# EasyEDA Pro project ProPrj_AmatronWithOpto_Flex_2026-01-19.epro

# Schematic AmatronWithOpto

## Sheets
1 SWITCH_OPTO
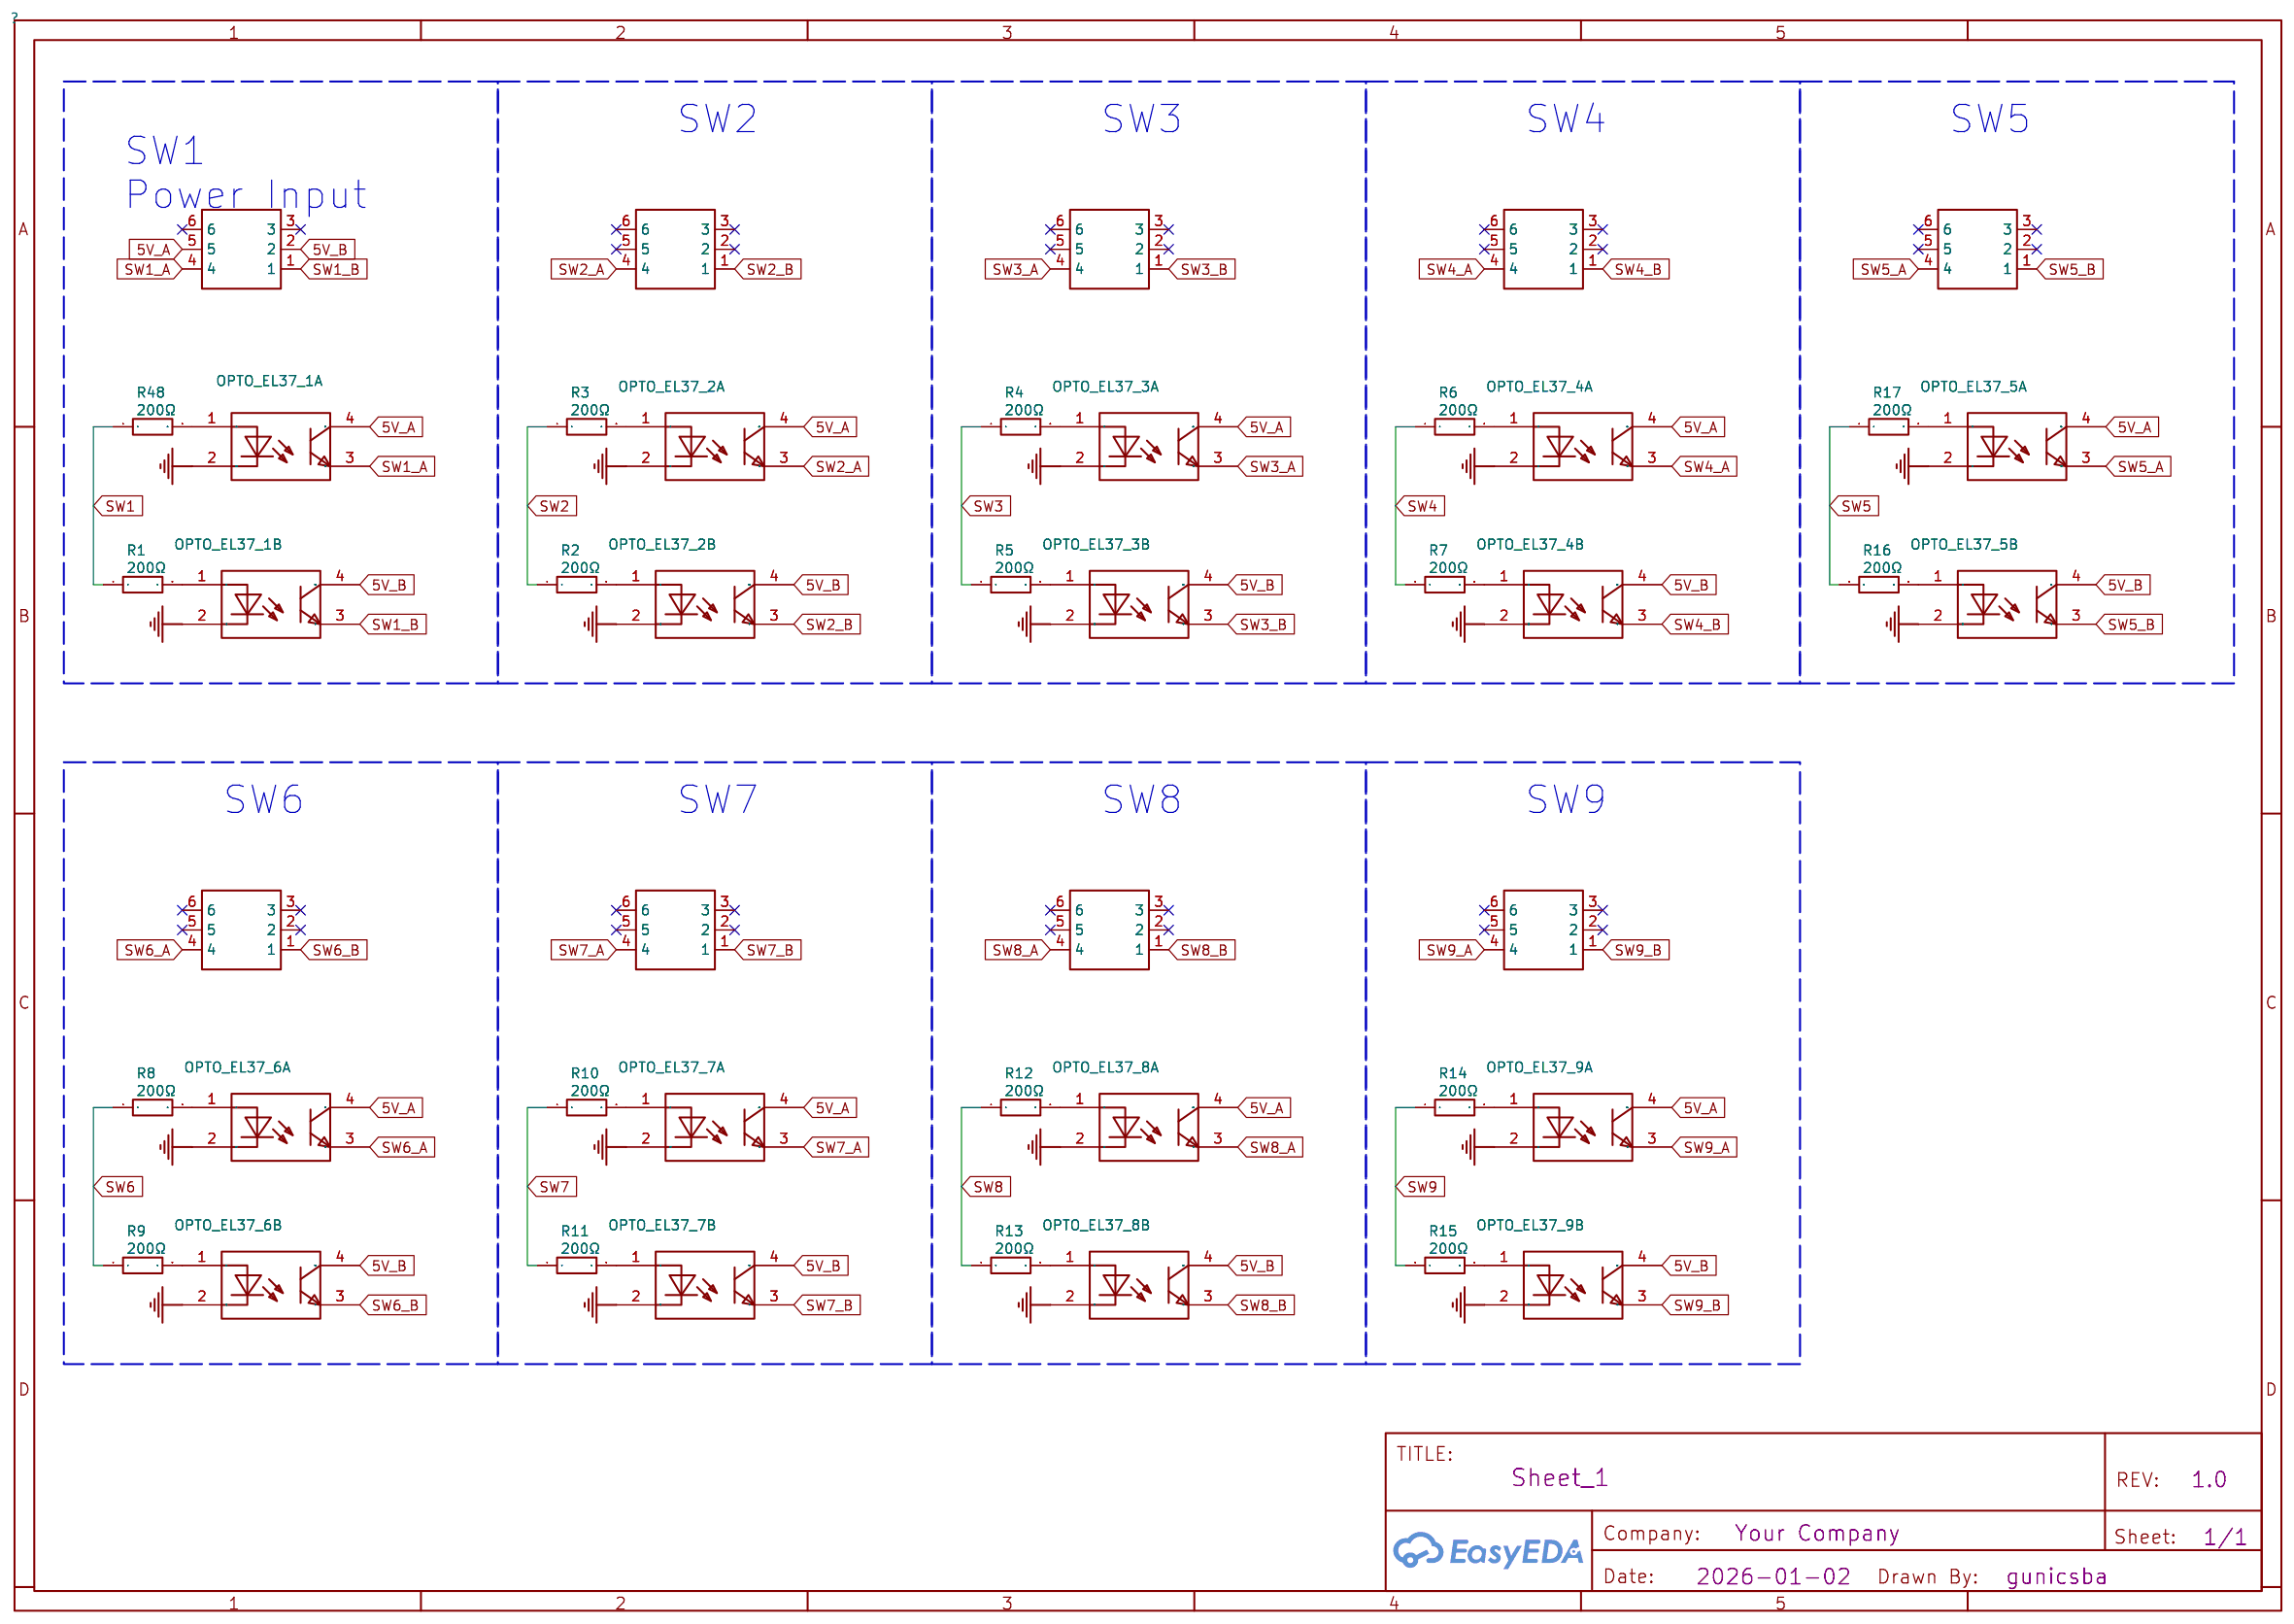
[diagram p0: SWITCH_OPTO]
2 DRIVER_POWER: Board Name: AmatronWithOpto; Create Date: 2026-01-02; Page Name: DRIVER_POWER; Project Name: AmatronWithOpto_Flex; Schematic Name: AmatronWithOpto; Update Date: 2026-01-02; Company: EasyEDA.com; Page Size: A4; Version: V1.0
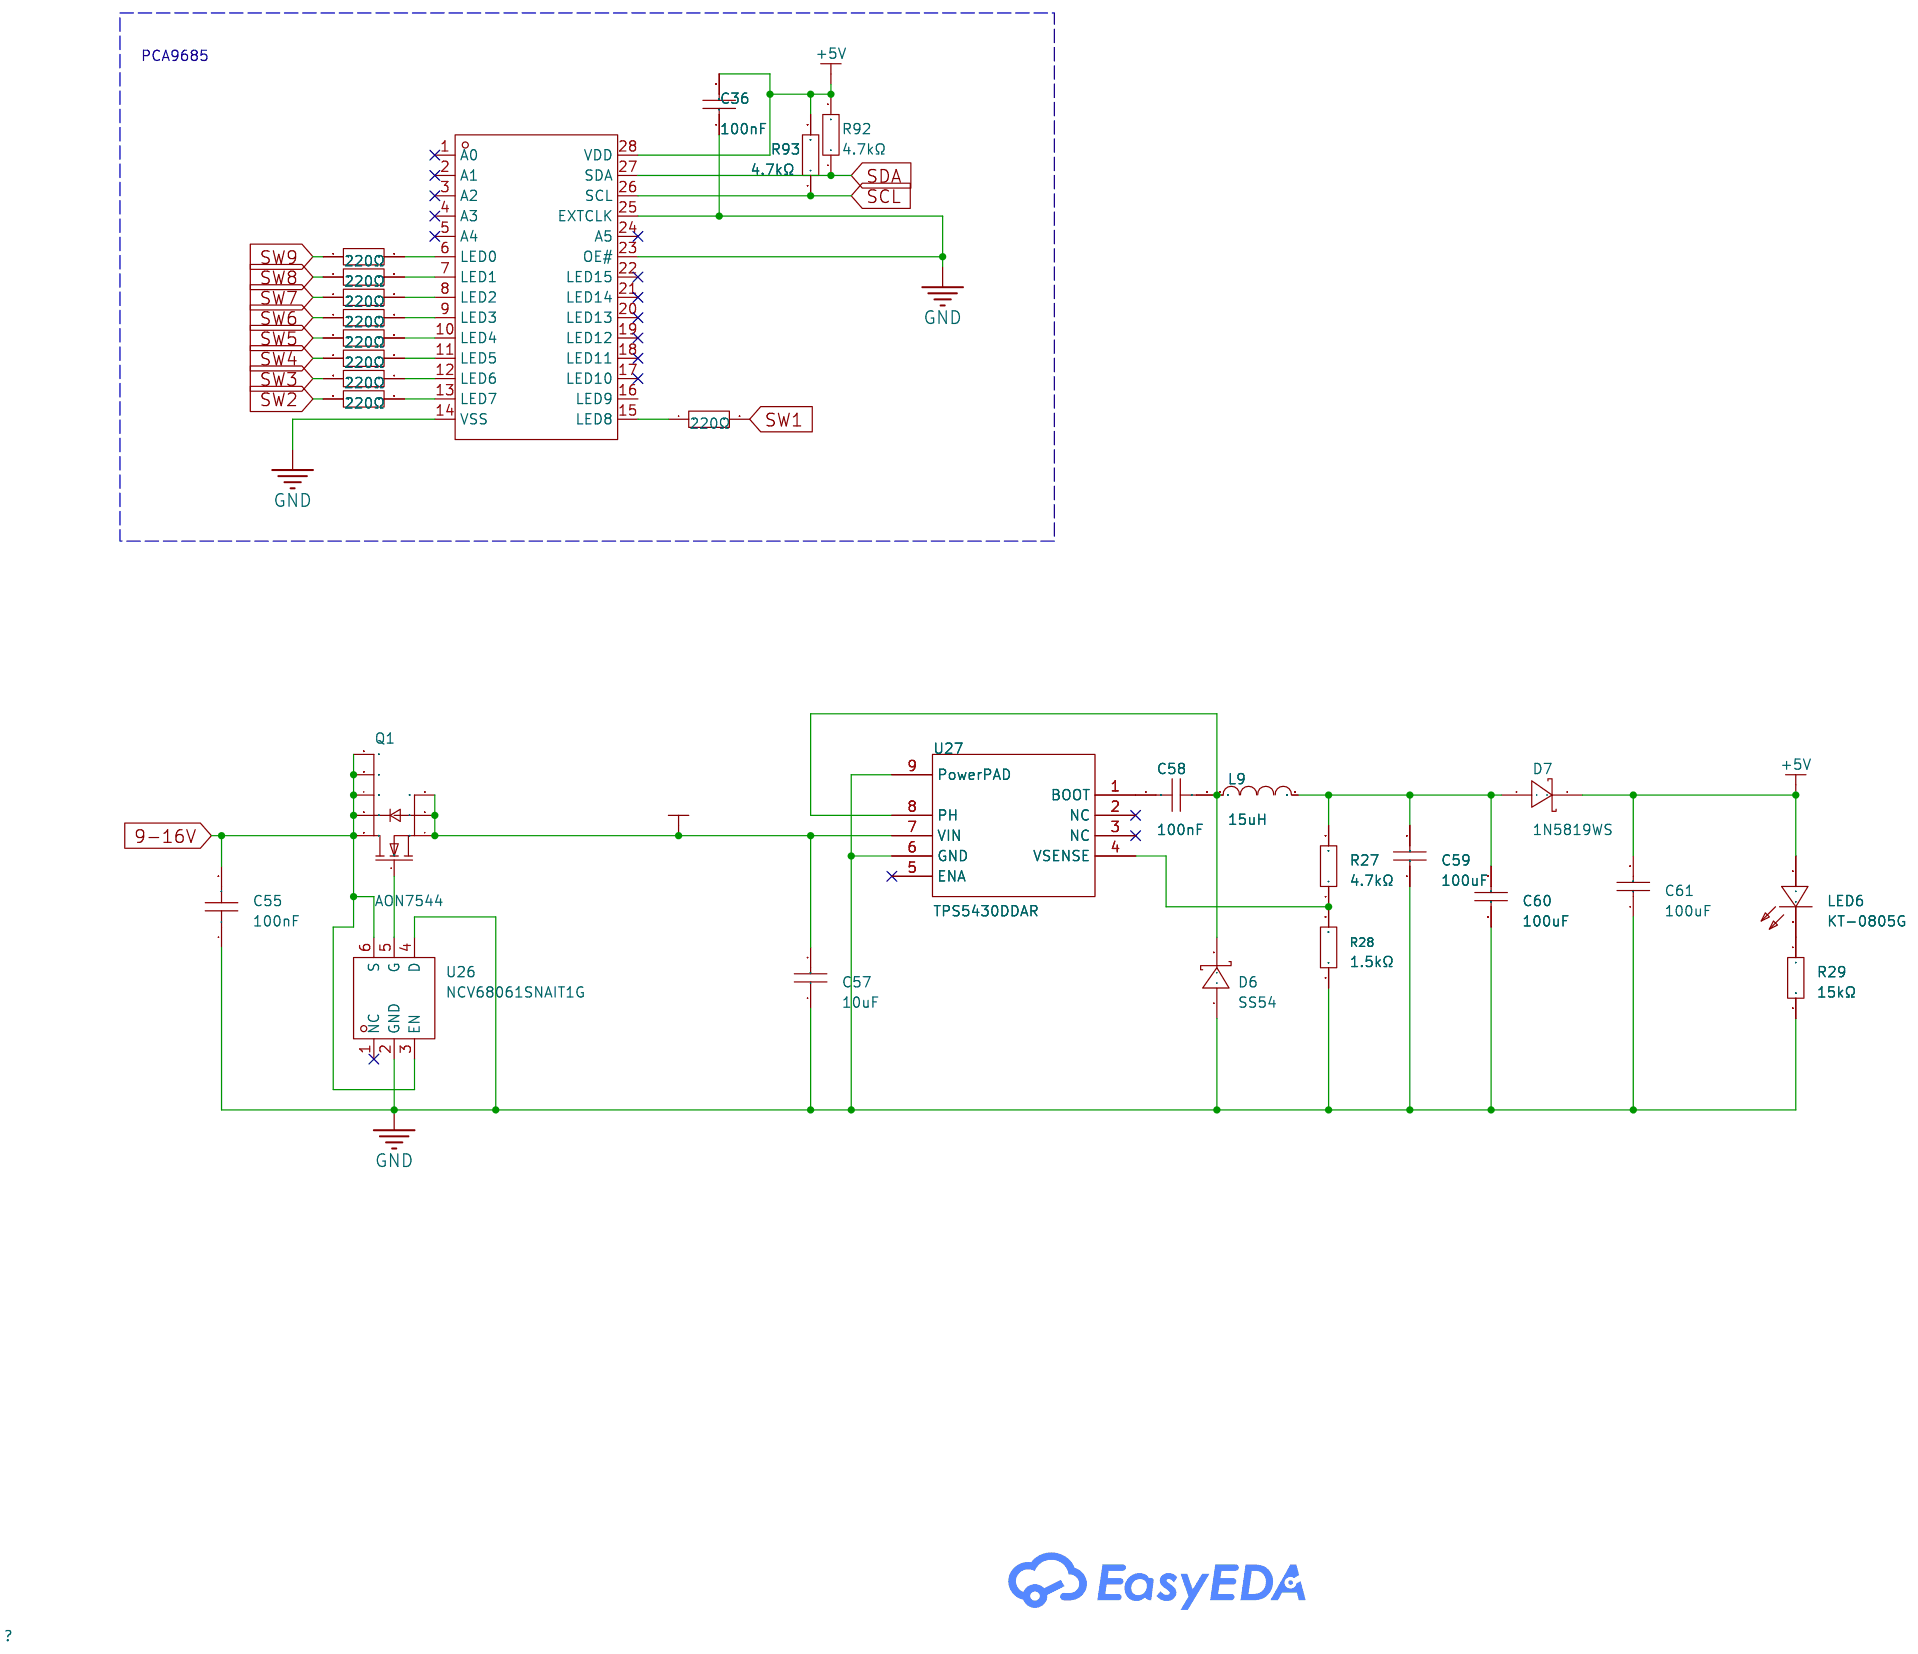
[diagram p1: DRIVER_POWER]

## Parts
sheet DRIVER_POWER
C36  100nF  [C0402]
C55  100nF  [C0603]
C57  10uF  [C1206]
C58  100nF  [C0603]
C59  100uF  [C1206]
C60  100uF  [C1206]
C61  100uF  [C1206]
D6  SS54  [SMA_L4.4-W2.8-LS5.4-R-RD]
D7  1N5819WS  [SOD-323_L1.8-W1.3-LS2.5-RD]
L9  15uH  [IND-SMD_L7.0-W6.6_FXL0630]
LED6  KT-0805G  [LED0805-R-RD]
Q1  AON7544  [DFN-8_L3.2-W3.1-P0.65-LS3.4-BL]
R27  4.7kΩ  [R0402]
R28  1.5kΩ  [R0402]
R29  15kΩ  [R0402]
R50  220Ω  [R0402]
R51  220Ω  [R0402]
R52  220Ω  [R0402]
R53  220Ω  [R0402]
R54  220Ω  [R0402]
R55  220Ω  [R0402]
R63  220Ω  [R0402]
R64  220Ω  [R0402]
R65  220Ω  [R0402]
R92  4.7kΩ  [R0805]
R93  4.7kΩ  [R0805]
U19  -  [TSSOP-28_L9.7-W4.4-P0.65-LS6.4-TL]
U26  NCV68061SNAIT1G  [TSOP-6_L3.0-W1.5-P0.95-BL]
U27  TPS5430DDAR  [ESOP-8_L4.9-W3.9-P1.27-LS6.0-TL-EP]
sheet SWITCH_OPTO
OPTO_EL37_1A  Speed Pulse  [SOP-4_L4.4-W2.8-P1.27-LS7.0-TL]
OPTO_EL37_1B  Speed Pulse  [SOP-4_L4.4-W2.8-P1.27-LS7.0-TL]
OPTO_EL37_2A  Speed Pulse  [SOP-4_L4.4-W2.8-P1.27-LS7.0-TL]
OPTO_EL37_2B  Speed Pulse  [SOP-4_L4.4-W2.8-P1.27-LS7.0-TL]
OPTO_EL37_3A  Speed Pulse  [SOP-4_L4.4-W2.8-P1.27-LS7.0-TL]
OPTO_EL37_3B  Speed Pulse  [SOP-4_L4.4-W2.8-P1.27-LS7.0-TL]
OPTO_EL37_4A  Speed Pulse  [SOP-4_L4.4-W2.8-P1.27-LS7.0-TL]
OPTO_EL37_4B  Speed Pulse  [SOP-4_L4.4-W2.8-P1.27-LS7.0-TL]
OPTO_EL37_5A  Speed Pulse  [SOP-4_L4.4-W2.8-P1.27-LS7.0-TL]
OPTO_EL37_5B  Speed Pulse  [SOP-4_L4.4-W2.8-P1.27-LS7.0-TL]
OPTO_EL37_6A  Speed Pulse  [SOP-4_L4.4-W2.8-P1.27-LS7.0-TL]
OPTO_EL37_6B  Speed Pulse  [SOP-4_L4.4-W2.8-P1.27-LS7.0-TL]
OPTO_EL37_7A  Speed Pulse  [SOP-4_L4.4-W2.8-P1.27-LS7.0-TL]
OPTO_EL37_7B  Speed Pulse  [SOP-4_L4.4-W2.8-P1.27-LS7.0-TL]
OPTO_EL37_8A  Speed Pulse  [SOP-4_L4.4-W2.8-P1.27-LS7.0-TL]
OPTO_EL37_8B  Speed Pulse  [SOP-4_L4.4-W2.8-P1.27-LS7.0-TL]
OPTO_EL37_9A  Speed Pulse  [SOP-4_L4.4-W2.8-P1.27-LS7.0-TL]
OPTO_EL37_9B  Speed Pulse  [SOP-4_L4.4-W2.8-P1.27-LS7.0-TL]
R1  200Ω  [R0805]
R2  200Ω  [R0805]
R3  200Ω  [R0805]
R4  200Ω  [R0805]
R5  200Ω  [R0805]
R6  200Ω  [R0805]
R7  200Ω  [R0805]
R8  200Ω  [R0805]
R9  200Ω  [R0805]
R10  200Ω  [R0805]
R11  200Ω  [R0805]
R12  200Ω  [R0805]
R13  200Ω  [R0805]
R14  200Ω  [R0805]
R15  200Ω  [R0805]
R16  200Ω  [R0805]
R17  200Ω  [R0805]
R48  200Ω  [R0805]
U1  1MD1T1B1M1QES-5  [SW-TH_6P-L12.7-W11.4-P4.7-LS4.8_1MD1T1B1M1QES-5]  (no BOM)
U2  1MD1T1B1M1QES-5  [SW-TH_6P-L12.7-W11.4-P4.7-LS4.8_1MD1T1B1M1QES-5]  (no BOM)
U3  1MD1T1B1M1QES-5  [SW-TH_6P-L12.7-W11.4-P4.7-LS4.8_1MD1T1B1M1QES-5]  (no BOM)
U4  1MD1T1B1M1QES-5  [SW-TH_6P-L12.7-W11.4-P4.7-LS4.8_1MD1T1B1M1QES-5]  (no BOM)
U5  1MD1T1B1M1QES-5  [SW-TH_6P-L12.7-W11.4-P4.7-LS4.8_1MD1T1B1M1QES-5]  (no BOM)
U6  1MD1T1B1M1QES-5  [SW-TH_6P-L12.7-W11.4-P4.7-LS4.8_1MD1T1B1M1QES-5]  (no BOM)
U7  1MD1T1B1M1QES-5  [SW-TH_6P-L12.7-W11.4-P4.7-LS4.8_1MD1T1B1M1QES-5]  (no BOM)
U8  1MD1T1B1M1QES-5  [SW-TH_6P-L12.7-W11.4-P4.7-LS4.8_1MD1T1B1M1QES-5]  (no BOM)
U9  1MD1T1B1M1QES-5  [SW-TH_6P-L12.7-W11.4-P4.7-LS4.8_1MD1T1B1M1QES-5]  (no BOM)

## Library data of the parts
C36 = CL05B104KO5NNNC: Capacitance: Tolerance:±10% Tolerance:±10% Voltage Rated: Temperature Coefficient:; LCSC Part Name: 100nF ±10% 16V; Supplier Part: C1525; Manufacturer: SAMSUNG(三星); Supplier Footprint: 0402; JLCPCB Part Class: Basic Part; Datasheet: https://atta.szlcsc.com/upload/public/pdf/source/20160103/1457707674891.pdf; Supplier: LCSC; Tolerance: ±10%
C55 C58 = CC0603KRX7R9BB104: Capacitance:100nF Tolerance:±10% Tolerance:±10% Voltage Rating:50V Temperature Coefficient:X7R; LCSC Part Name: 100nF ±10% 50V; Supplier Part: C14663; Manufacturer: YAGEO(国巨); Supplier Footprint: 0603; JLCPCB Part Class: Basic Part; Datasheet: https://item.szlcsc.com/datasheet/CC0603KRX7R9BB104/15331.html; Supplier: LCSC; Tolerance: ±10%; Voltage Rating: 50V; Temperature Coefficient: X7R
C57 = CL31A106KBHNNNE: Capacitance:10uF Tolerance:±10% Tolerance:±10% Voltage Rating:50V Temperature Coefficient:X5R; LCSC Part Name: 10uF ±10% 50V; Supplier Part: C13585; Manufacturer: SAMSUNG(三星); Supplier Footprint: 1206; JLCPCB Part Class: Basic Part; Datasheet: https://item.szlcsc.com/datasheet/CL31A106KBHNNNE/14236.html; Supplier: LCSC; Tolerance: ±10%; Voltage Rating: 50V; Temperature Coefficient: X5R
C59-C61 = CL31A107MQHNNNE: Capacitance:100uF Tolerance:±20% Tolerance:±20% Voltage Rating:6.3V Temperature Coefficient:X5R; LCSC Part Name: 100uF ±20% 6.3V; Supplier Part: C15008; Manufacturer: SAMSUNG(三星); Supplier Footprint: 1206; JLCPCB Part Class: Basic Part; Datasheet: https://item.szlcsc.com/datasheet/CL31A107MQHNNNE/15681.html; Supplier: LCSC; Tolerance: ±20%; Voltage Rating: 6.3V; Temperature Coefficient: X5R
D6 = SS54_C22452: Diode Configuration:Independent Voltage - Forward(Vf@If):550mV@5A Voltage - DC Reverse(Vr):40V Current - Rectified:5A Reverse Leakage Current (Ir):1mA@40V Operating Junction Temperature Range:-55℃~+125℃ Operating Junction Temperature Range:-55℃~+125℃; LCSC Part Name: 电压:40V 电流:5A; Supplier Part: C22452; Manufacturer: MDD(辰达半导体); Supplier Footprint: SMA(DO-214AC); JLCPCB Part Class: Basic Part; Datasheet: https://item.szlcsc.com/datasheet/SS54/23178.html; Supplier: LCSC; Diode Configuration: Independent; Voltage - Forward(Vf@If): 550mV@5A; Voltage - DC Reverse(Vr): 40V; Current - Rectified: 5A; Reverse Leakage Current (Ir): 1mA@40V; Operating Junction Temperature Range: -55℃~+125℃
D7 = 1N5819WS_C191023: Voltage - Forward(Vf@If):600mV@1A Voltage - DC Reverse(Vr):40V Current - Rectified:1A Non-Repetitive Peak Forward Surge Current:25A; LCSC Part Name: 电压:40V 电流:1A; Supplier Part: C191023; Manufacturer: Hottech(合科泰); Supplier Footprint: SOD-323; JLCPCB Part Class: Basic Part; Datasheet: https://item.szlcsc.com/datasheet/1N5819WS/213850.html; Supplier: LCSC; Voltage - Forward(Vf@If): 600mV@1A; Voltage - DC Reverse(Vr): 40V; Current - Rectified: 1A; Non-Repetitive Peak Forward Surge Current: 25A
L9 = FXL0630-150-M: Inductance:15uH Tolerance:±20% Tolerance:±20% Current Rating:3A Current - Saturation(Isat):4A DC Resistance(DCR):115mΩ Type:Molded Inductor Ratings:-; LCSC Part Name: 15uH ±20%; Supplier Part: C177243; Manufacturer: cjiang(长江微电); Supplier Footprint: SMD,7x6.6mm; JLCPCB Part Class: Extended Part; Datasheet: https://item.szlcsc.com/datasheet/FXL0630-150-M/188635.html; Supplier: LCSC; Tolerance: ±20%; Current Rating: 3A; Current - Saturation(Isat): 4A; DC Resistance(DCR): 115mΩ; Type: Molded Inductor
LED6 = KT-0805G: Lamp Holder Type:- Illumination Color:Emerald Green Voltage - Forward(Vf):2.6V~3.1V Voltage - Forward(Vf):2.6V~3.1V Power(Watts):100mW Forward Current:5mA Wavelength - Dominant:513nm~528nm Wavelength - Dominant:513nm~528nm Peak Wavelength:525nm Diode Conf; LCSC Part Name: 0805 翠绿 高亮; Supplier Part: C2297; Manufacturer: KENTO; Supplier Footprint: 0805; JLCPCB Part Class: Basic Part; Datasheet: https://item.szlcsc.com/datasheet/KT-0805G/2670.html; Supplier: LCSC; Illumination Color: Emerald Green; Voltage - Forward(Vf): 2.6V~3.1V; Power(Watts): 100mW; Forward Current: 5mA; Wavelength - Dominant: 513nm~528nm; Peak Wavelength: 525nm; Luminous Intensity: 430mcd; Viewing Angle: 120°; Operating Temperature: -40℃~+85℃
Q1 = AON7544_C5261066: Number:1 N-Channel Drain to Source Voltage:30V Current - Continuous Drain(Id):100A RDS(on):5.5mΩ@10V,30A Pd - Power Dissipation:62.5W Gate Threshold Voltage (Vgs(th)):2.5V Gate Charge(Qg):31.6nC@4.5V Input Capacitance(Ciss):3.075nF@15V Reverse Transfer Ca; LCSC Part Name: 1个N沟道 耐压:30V 电流:100A; Supplier Part: C5261066; Manufacturer: HXY MOSFET(华轩阳电子); Supplier Footprint: DFN3x3-8L; JLCPCB Part Class: Extended Part; Datasheet: https://item.szlcsc.com/datasheet/AON7544/5983765.html; Supplier: LCSC; Number: 1 N-Channel; Drain to Source Voltage: 30V; Current - Continuous Drain(Id): 100A; RDS(on): 5.5mΩ@10V,30A; Pd - Power Dissipation: 62.5W; Gate Threshold Voltage (Vgs(th)): 2.5V; Gate Charge(Qg): 31.6nC@4.5V; Input Capacitance(Ciss): 3.075nF@15V; Reverse Transfer Capacitance (Crss@Vds): 315pF@15V; Operating Temperature: -55℃~+150℃
R27 = 0402WGF4701TCE: Type:Thick Film Resistor Resistance:4.7kΩ Tolerance:±1% Tolerance:±1% Power(Watts):62.5mW Voltage-Supply(Max):50V Temperature Coefficient:±100ppm/℃ Temperature Coefficient:±100ppm/℃ Operating Temperature:-55℃~+155℃ Operating Temperature:-55℃~+155℃; LCSC Part Name: 4.7kΩ ±1% 62.5mW 厚膜电阻; Supplier Part: C25900; Manufacturer: UNI-ROYAL(厚声); Supplier Footprint: 0402; JLCPCB Part Class: Basic Part; Datasheet: https://item.szlcsc.com/datasheet/0402WGF4701TCE/26643.html; Supplier: LCSC; Type: Thick Film Resistor; Tolerance: ±1%; Power(Watts): 62.5mW; Voltage-Supply(Max): 50V; Temperature Coefficient: ±100ppm/℃; Operating Temperature: -55℃~+155℃
R28 = 0402WGF1501TCE: Type:Thick Film Resistors Resistance:1.5kΩ Tolerance:±1% Tolerance:±1% Power(Watts): Overload Voltage (Max): Temperature Coefficient:±100ppm/℃ Temperature Coefficient:±100ppm/℃ Operating Temperature Range:-55℃~+155℃ Operating Temperature Range:-55℃~+155℃; LCSC Part Name: 1.5kΩ ±1% 62.5mW 厚膜电阻; Supplier Part: C25867; Manufacturer: UNI-ROYAL(厚声); Supplier Footprint: 0402; JLCPCB Part Class: Basic Part; Datasheet: https://atta.szlcsc.com/upload/public/pdf/source/20200306/C422600_1E6D84923E4A46A82E41ADD87F860B5C.pdf; Supplier: LCSC; Type: Thick Film Resistors; Tolerance: ±1%; Temperature Coefficient: ±100ppm/℃; Operating Temperature Range: -55℃~+155℃
R29 = 0402WGF1502TCE: 电阻类型:厚膜电阻;阻值:15kΩ;精度:±1%;功率:62.5mW;; LCSC Part Name: 15kΩ ±1% 62.5mW; Supplier Part: C25756; Manufacturer: UNI-ROYAL(厚声); Supplier Footprint: 0402; JLCPCB Part Class: Basic Part; Datasheet: https://atta.szlcsc.com/upload/public/pdf/source/20200306/C422600_1E6D84923E4A46A82E41ADD87F860B5C.pdf; Supplier: LCSC; Type: 厚膜电阻; Tolerance: ±1%; Power(Watts): 62.5mW; Temperature Coefficient: ±100ppm/℃; Overload Voltage (Max): 50V; Operating Temperature Range: -55℃~+155℃
R50-R55 R63-R65 = 0402WGF2200TCE: Resistance: Tolerance:±1% Tolerance:±1% Power(Watts): Overload Voltage (Max): Temperature Coefficient:±100ppm/℃ Temperature Coefficient:±100ppm/℃ Type:Thick Film Resistors Operating Temperature Range:-55℃~+155℃ Operating Temperature Range:-55℃~+155℃; LCSC Part Name: 220Ω ±1% 62.5mW 厚膜电阻; Supplier Part: C25091; Manufacturer: UNI-ROYAL(厚声); Supplier Footprint: 0402; JLCPCB Part Class: Basic Part; Datasheet: https://atta.szlcsc.com/upload/public/pdf/source/20200306/C422600_1E6D84923E4A46A82E41ADD87F860B5C.pdf; Supplier: LCSC; Tolerance: ±1%; Temperature Coefficient: ±100ppm/℃; Type: Thick Film Resistors; Operating Temperature Range: -55℃~+155℃
R92 R93 = 0805W8F4701T5E: Resistance:4700Ω Tolerance:±1% Tolerance:±1% Power(Watts): Overload Voltage (Max): Temperature Coefficient:±100ppm/℃ Temperature Coefficient:±100ppm/℃ Type:Thick Film Resistors Operating Temperature Range:-55℃~+155℃ Operating Temperature Range:-55℃~+155℃; LCSC Part Name: 4.7kΩ ±1% 125mW 厚膜电阻; Supplier Part: C17673; Manufacturer: UNI-ROYAL(厚声); Supplier Footprint: 0805; JLCPCB Part Class: Basic Part; Datasheet: https://atta.szlcsc.com/upload/public/pdf/source/20200306/C422600_1E6D84923E4A46A82E41ADD87F860B5C.pdf; Supplier: LCSC; Tolerance: ±1%; Temperature Coefficient: ±100ppm/℃; Type: Thick Film Resistors; Operating Temperature Range: -55℃~+155℃
U19 = PCA9685PW,118: Supplier Part: C2678753; Manufacturer: NXP(恩智浦); Supplier Footprint: TSSOP-28; JLCPCB Part Class: ExtendedPart; Datasheet: https://atta.szlcsc.com/upload/public/pdf/source/20170908/C92206_1504870161626958140.pdf; Supplier: LCSC
U26 = NCV68061SNAIT1G: LCSC Part Name: NCV68061: Ideal Diode NMOS Controller; Supplier Part: C5206748; Manufacturer: onsemi(安森美); Supplier Footprint: TSOP-6; JLCPCB Part Class: Extended Part; Datasheet: https://item.szlcsc.com/datasheet/NCV68061SNAIT1G/5898869.html; Supplier: LCSC
U27 = TPS5430DDAR: Function:Buck Voltage - Supply:5.5V~36V Voltage - Supply:5.5V~36V Output Voltage:1.221V~32.04V Output Voltage:1.221V~32.04V Output Current:3A Frequency - Switching:500kHz Frequency - Switching:500kHz Operating Temperature:-40℃~+125℃@(TJ) Operating Tempera; LCSC Part Name: 宽输入范围、3A输出电流的降压转换器; Supplier Part: C9864; Manufacturer: TI(德州仪器); Supplier Footprint: SOIC-8-EP; JLCPCB Part Class: Basic Part; Datasheet: https://www.ti.com/lit/ds/symlink/tps5430.pdf; Supplier: LCSC; Function: Buck; Voltage - Supply: 5.5V~36V; Output Voltage: 1.221V~32.04V; Output Current: 3A; Frequency - Switching: 500kHz; Operating Temperature: -40℃~+125℃@(TJ); Synchronous Rectifier: No; Number of Outputs: 1; Topology: Buck; Quiescent Current: 4.4mA; Switch tube (built-in/external): Built-In; Output Type: Adjustable
OPTO_EL37_1A OPTO_EL37_1B OPTO_EL37_2A OPTO_EL37_2B OPTO_EL37_3A OPTO_EL37_3B OPTO_EL37_4A OPTO_EL37_4B OPTO_EL37_5A OPTO_EL37_5B OPTO_EL37_6A OPTO_EL37_6B OPTO_EL37_7A OPTO_EL37_7B OPTO_EL37_8A OPTO_EL37_8B OPTO_EL37_9A OPTO_EL37_9B = Speed Pulse: Supplier: LCSC; Manufacturer: EVERLIGHT(亿光); Manufacturer Part: EL3H7(B)(TA)-G; Supplier Part: C32565; JLCPCB Part Class: Basic Part; spicePre: U; spiceSymbolName: EL3H7(B)(TA)-G
R1-R17 R48 = 200Ω: Supplier: LCSC; Manufacturer: UNI-ROYAL(厚声); Manufacturer Part: 0805W8F2000T5E; Supplier Part: C17540; Resistance: 200; JLCPCB Part Class: Basic Part; nameAlias: Resistance; spicePre: R; spiceSymbolName: 0805W8F2000T5E
U1-U9 = 1MD1T1B1M1QES-5: Supplier: LCSC; Supplier Part: C545197; Manufacturer: Dailywell(德利威); JLCPCB Part Class: Extended Part; Contributor: lcsc; spicePre: U

## Nets
5V_A: OPTO_EL37_1A.4(COL) OPTO_EL37_2A.4(COL) OPTO_EL37_3A.4(COL) OPTO_EL37_4A.4(COL) OPTO_EL37_5A.4(COL) OPTO_EL37_6A.4(COL) OPTO_EL37_7A.4(COL) OPTO_EL37_8A.4(COL) OPTO_EL37_9A.4(COL) U1.5
5V_B: OPTO_EL37_1B.4(COL) OPTO_EL37_2B.4(COL) OPTO_EL37_3B.4(COL) OPTO_EL37_4B.4(COL) OPTO_EL37_5B.4(COL) OPTO_EL37_6B.4(COL) OPTO_EL37_7B.4(COL) OPTO_EL37_8B.4(COL) OPTO_EL37_9B.4(COL) U1.2
+5V: C36.2 C61.2 D7.1(K) LED6.1(A) R92.2 R93.2 U19.28(VDD)
+12V: C57.2 Q1.1(S) Q1.2(S) Q1.3(S) U27.7(VIN)
GND: C36.1 C55.1 C57.1 C59.1 C60.1 C61.1 D6.1(A) OPTO_EL37_1A.2(CAT) OPTO_EL37_1B.2(CAT) OPTO_EL37_2A.2(CAT) OPTO_EL37_2B.2(CAT) OPTO_EL37_3A.2(CAT) OPTO_EL37_3B.2(CAT) OPTO_EL37_4A.2(CAT) OPTO_EL37_4B.2(CAT) OPTO_EL37_5A.2(CAT) OPTO_EL37_5B.2(CAT) OPTO_EL37_6A.2(CAT) OPTO_EL37_6B.2(CAT) OPTO_EL37_7A.2(CAT) OPTO_EL37_7B.2(CAT) OPTO_EL37_8A.2(CAT) OPTO_EL37_8B.2(CAT) OPTO_EL37_9A.2(CAT) OPTO_EL37_9B.2(CAT) R28.1 R29.2 U19.14(VSS) U19.23(OE#) U19.25(EXTCLK) U26.2(GND) U26.4(D) U27.6(GND) U27.9(PowerPAD)
9-16V: C55.2 Q1.5(D) Q1.6(D) Q1.7(D) Q1.8(D) Q1.9(D) U26.3(EN) U26.6(S)
SCL: R93.1 U19.26(SCL)
SDA: R92.1 U19.27(SDA)
SW1: R1.1 R48.1 R63.2
SW1_A: OPTO_EL37_1A.3(EM) U1.4
SW1_B: OPTO_EL37_1B.3(EM) U1.1
SW2: R2.1 R3.1 R64.2
SW2_A: OPTO_EL37_2A.3(EM) U2.4
SW2_B: OPTO_EL37_2B.3(EM) U2.1
SW3: R4.1 R5.1 R65.2
SW3_A: OPTO_EL37_3A.3(EM) U3.4
SW3_B: OPTO_EL37_3B.3(EM) U3.1
SW4: R6.1 R7.1 R50.1
SW4_A: OPTO_EL37_4A.3(EM) U4.4
SW4_B: OPTO_EL37_4B.3(EM) U4.1
SW5: R16.1 R17.1 R51.1
SW5_A: OPTO_EL37_5A.3(EM) U9.4
SW5_B: OPTO_EL37_5B.3(EM) U9.1
SW6: R8.1 R9.1 R52.1
SW6_A: OPTO_EL37_6A.3(EM) U5.4
SW6_B: OPTO_EL37_6B.3(EM) U5.1
SW7: R10.1 R11.1 R53.1
SW7_A: OPTO_EL37_7A.3(EM) U6.4
SW7_B: OPTO_EL37_7B.3(EM) U6.1
SW8: R12.1 R13.1 R54.1
SW8_A: OPTO_EL37_8A.3(EM) U7.4
SW8_B: OPTO_EL37_8B.3(EM) U7.1
SW9: R14.1 R15.1 R55.1
SW9_A: OPTO_EL37_9A.3(EM) U8.4
SW9_B: OPTO_EL37_9B.3(EM) U8.1
$1N1117: OPTO_EL37_1A.1(AN) R48.2
$1N1124: OPTO_EL37_1B.1(AN) R1.2
$1N1139: OPTO_EL37_2B.1(AN) R2.2
$1N1144: OPTO_EL37_2A.1(AN) R3.2
$1N1153: OPTO_EL37_3A.1(AN) R4.2
$1N1160: OPTO_EL37_3B.1(AN) R5.2
$1N1171: OPTO_EL37_4A.1(AN) R6.2
$1N1178: OPTO_EL37_4B.1(AN) R7.2
$1N1189: OPTO_EL37_6A.1(AN) R8.2
$1N1196: OPTO_EL37_6B.1(AN) R9.2
$1N1207: OPTO_EL37_7A.1(AN) R10.2
$1N1214: OPTO_EL37_7B.1(AN) R11.2
$1N1225: OPTO_EL37_8A.1(AN) R12.2
$1N1232: OPTO_EL37_8B.1(AN) R13.2
$1N1243: OPTO_EL37_9A.1(AN) R14.2
$1N1250: OPTO_EL37_9B.1(AN) R15.2
$1N1265: OPTO_EL37_5B.1(AN) R16.2
$1N1270: OPTO_EL37_5A.1(AN) R17.2
$2N1134: R64.1 U19.13(LED7)
$2N1136: R65.1 U19.12(LED6)
$2N1138: R50.2 U19.11(LED5)
$2N1140: R51.2 U19.10(LED4)
$2N1142: R52.2 U19.9(LED3)
$2N1144: R53.2 U19.8(LED2)
$2N1161: R63.1 U19.15(LED8)
$2N1591: R54.2 U19.7(LED1)
$2N1593: R55.2 U19.6(LED0)
$2N2475: C58.2 D6.2(K) L9.1 U27.8(PH)
$2N2476: LED6.2(K) R29.1
$2N2478: C59.2 C60.2 D7.2(A) L9.2 R27.2
$2N2479: R27.1 R28.2 U27.4(VSENSE)
$2N2480: C58.1 U27.1(BOOT)
$2N2481: Q1.4(G) U26.5(G)

Not connected (* = marked no-connect by the designer): U1 3* 6*; U2 2* 3* 5* 6*; U3 2* 3* 5* 6*; U4 2* 3* 5* 6*; U5 2* 3* 5* 6*; U6 2* 3* 5* 6*; U7 2* 3* 5* 6*; U8 2* 3* 5* 6*; U9 2* 3* 5* 6*; U19 1(A0)* 2(A1)* 3(A2)* 4(A3)* 5(A4)* 16(LED9) 17(LED10)* 18(LED11)* 19(LED12)* 20(LED13)* 21(LED14)* 22(LED15)* 24(A5)*; U26 1(NC)*; U27 2(NC)* 3(NC)* 5(ENA)*

## Notes on the sheets
sheet 1
- SW1
  Power Input
- SW2
- SW3
- SW4
- SW5
- SW6
- SW7
- SW8
- SW9
sheet 2
- PCA9685

# Board PCB_AmatronWithOpto
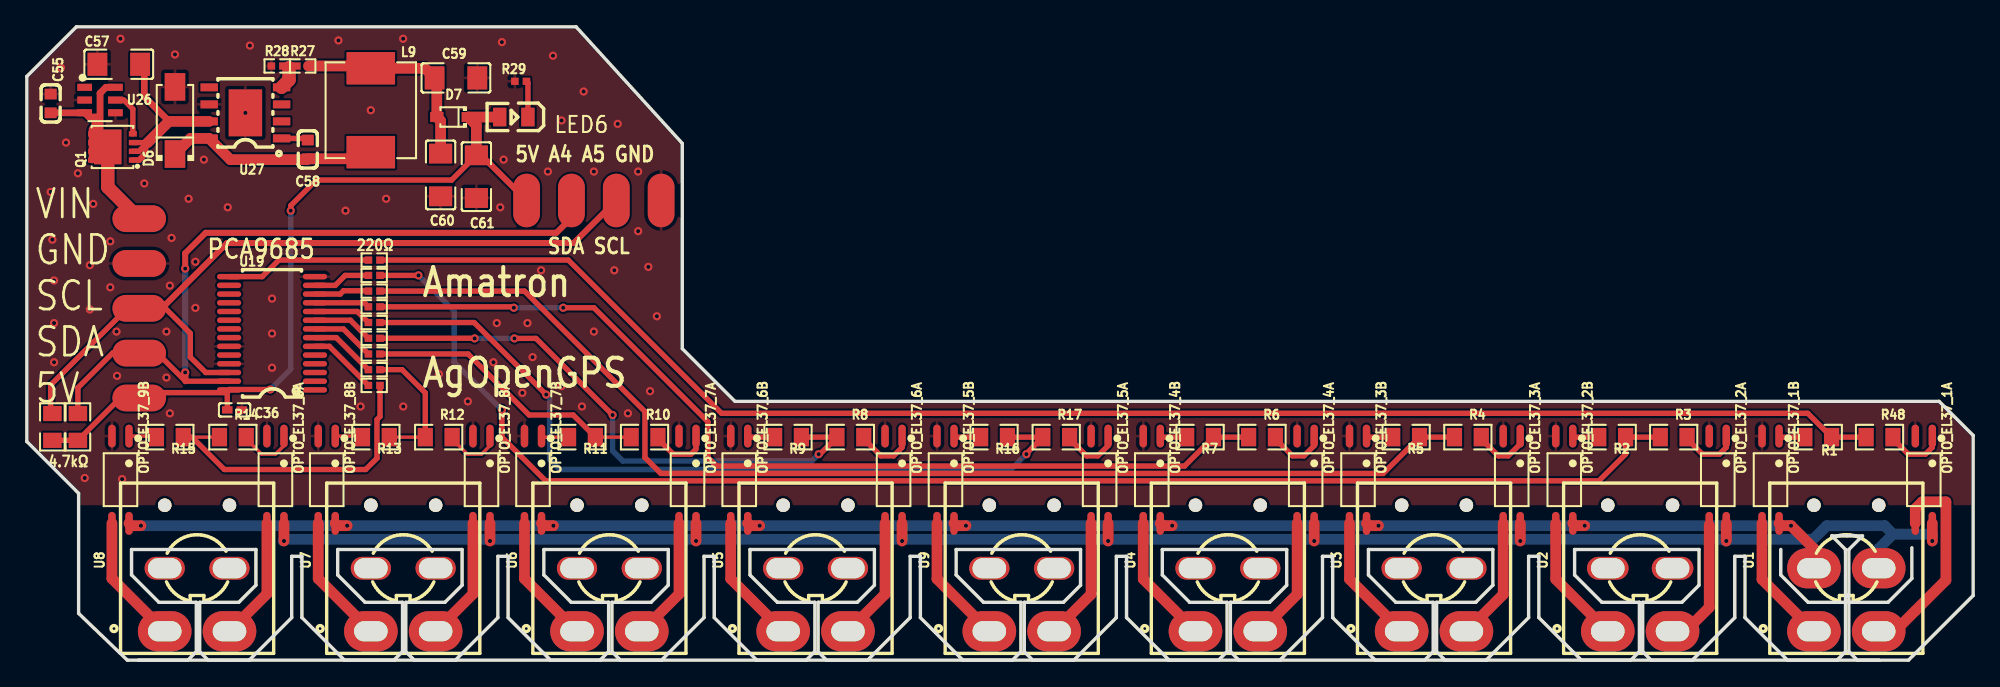
[diagram p2: board, top side]
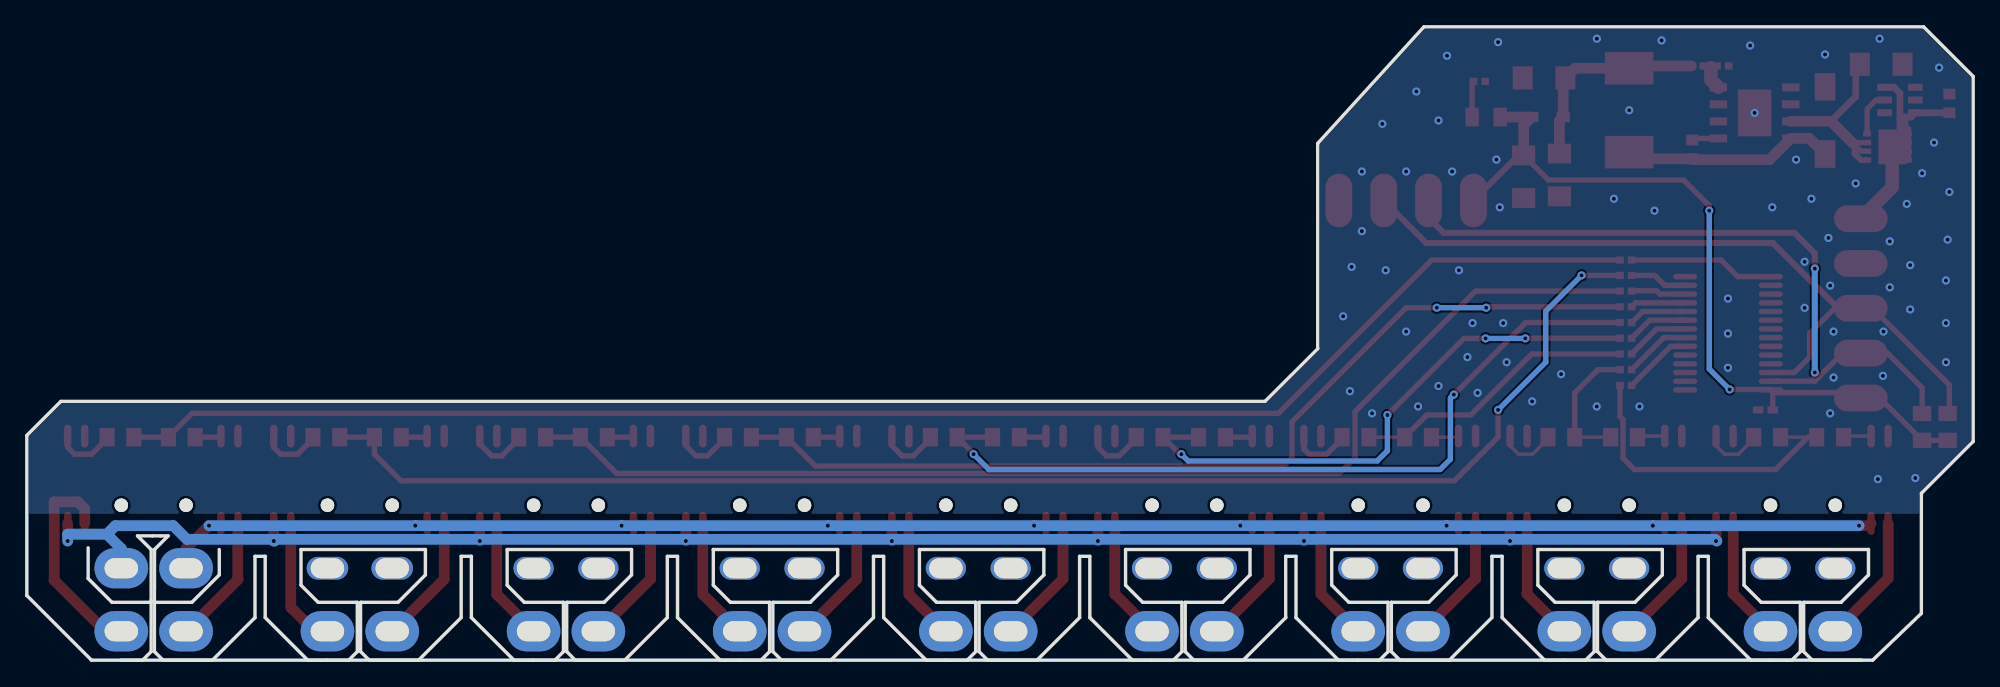
[diagram p3: board, bottom side, seen from below]

Outline 145.16 x 47.24 mm; copper layers: Top Layer, Bottom Layer. Coordinates in mm from the lower left corner of the outline.
Outline path: 8.31,0 12.01,0 12.64,0.64 12.64,4.32 9.85,4.32 7.81,6.36 7.81,8.25 17.09,8.25 17.09,5.6 15.81,4.32 12.89,4.32 12.89,0.63 13.53,0 15.15,0 ; 15.16,0 16.58,0 19.76,3.17 19.76,7.75 20.52,7.75 20.52,3.17 23.69,0 27.38,0 28.02,0.64 28.02,4.32 25.23,4.32 23.19,6.36 23.19,8.25 32.46,8.25 32.46,5.6 31.19,4.32 28.27,4.32 28.27,0.63 28.9,0 30.52,0 ; 30.53,0 31.96,0 35.13,3.17 35.13,7.75 35.89,7.75 35.89,3.17 39.06,0 42.76,0 43.39,0.64 43.39,4.32 40.6,4.32 38.56,6.36 38.56,8.25 47.84,8.25 47.84,5.6 46.56,4.32 43.64,4.32 43.64,0.63 44.28,0 47.33,0 50.51,3.17 50.51,7.75 51.27,7.75 51.27,3.17 54.44,0 58.13,0 58.77,0.64 58.77,4.32 55.98,4.32 53.94,6.36 53.94,8.25 63.21,8.25 63.21,5.6 61.94,4.32 59.02,4.32 59.02,0.63 59.65,0 61.27,0 ; 61.28,0 62.71,0 65.88,3.17 65.88,7.75 66.64,7.75 66.64,3.17 69.81,0 73.51,0 74.14,0.64 74.14,4.32 71.35,4.32 69.31,6.36 69.31,8.25 78.59,8.25 78.59,5.6 77.31,4.32 74.39,4.32 74.39,0.63 75.02,0 76.65,0 ; 76.66,0 78.08,0 81.26,3.17 81.26,7.75 82.02,7.75 82.02,3.17 85.19,0 88.88,0 89.52,0.64 89.52,4.32 86.72,4.32 84.69,6.36 84.69,8.25 93.96,8.25 93.96,5.6 92.69,4.32 89.77,4.32 89.77,0.63 90.4,0 92.02,0 ; 92.03,0 93.46,0 96.63,3.17 96.63,7.75 97.39,7.75 97.39,3.17 100.56,0 104.26,0 104.89,0.64 104.89,4.32 102.1,4.32 100.06,6.36 100.06,8.25 109.34,8.25 109.34,5.6 108.06,4.32 105.14,4.32 105.14,0.63 105.77,0 107.4,0 ; 107.41,0 108.83,0 112.01,3.17 112.01,7.75 112.77,7.75 112.77,3.17 115.94,0 119.63,0 120.27,0.64 120.27,4.32 117.47,4.32 115.44,6.36 115.44,8.25 124.71,8.25 124.71,5.6 123.44,4.32 120.52,4.32 120.52,0.63 121.15,0 122.77,0 ; 122.78,0 124.21,0 127.38,3.17 127.38,7.75 128.14,7.75 128.14,3.17 131.31,0 135.01,0 135.64,0.64 135.64,4.32 ; 130.81,8.25 130.81,6.36 132.85,4.32 135.64,4.32 ; 135.64,4.32 135.64,8.25 134.62,9.27 135.76,9.27 ; 135.78,9.27 136.91,9.27 135.89,8.25 135.89,0.63 136.52,0 138.15,0 ; 135.89,4.32 138.81,4.32 140.59,6.1 140.59,8.38 ; 0,43.54 3.7,47.24 40.96,47.24 48.88,38.55 48.88,23.23 52.81,19.3 142.62,19.3 145.16,16.76 145.16,4.83 140.33,0 7.5,0 3.86,3.49 3.86,12.45 0,16.31 0,43.54
Stack: Top Layer 0.035mm / Dielectric1 1.51mm FR4 er 4.5 / Bottom Layer 0.035mm

## Design rules (mm)
spacing Default (default): track to track 0.152, other pairs 0 to 0.152
track width Default (default): min 0.254, default 0.254, max 25.4
differential pair differentialPair (default): width min 0.127, default 0.254, max 2.54; gap min 0.152, default 0.152
via Default (default): diameter min 0.61, default 0.61, max 100.025; hole min 0.305, default 0.305, max 59.995

## Placement (name value [footprint] x y rotation side)
C36  100nF  [C0402]  15.49 18.67 180 top
C55  100nF  [C0603]  1.78 41.53 270 top
C57  10uF  [C1206]  6.86 44.45 0 top
C58  100nF  [C0603]  20.95 38.1 270 top
C59  100uF  [C1206]  32 43.43 180 top
C60  100uF  [C1206]  30.86 36.19 90 top
C61  100uF  [C1206]  33.53 36.07 90 top
D6  SS54  [SMA_L4.4-W2.8-LS5.4-R-RD]  11.05 40.26 90 top
D7  1N5819WS  [SOD-323_L1.8-W1.3-LS2.5-RD]  31.75 40.51 180 top
L9  15uH  [IND-SMD_L7.0-W6.6_FXL0630]  25.65 41.02 270 top
LED6  KT-0805G  [LED0805-R-RD]  36.32 40.51 180 top
NOREF  -  [Pad_e796]  8.38 29.59 90 top
NOREF#2  -  [Pad_e798]  8.38 26.25 90 top
NOREF#3  -  [Pad_e800]  8.38 19.56 90 top
NOREF#4  -  [Pad_e19]  40.62 34.29 0 top
NOREF#5  -  [Pad_e799]  8.38 22.9 90 top
NOREF#6  -  [Pad_e20]  37.27 34.29 0 top
NOREF#7  -  [Pad_e0]  47.31 34.29 0 top
NOREF#8  -  [Pad_e18]  43.96 34.29 0 top
NOREF#9  -  [Pad_e2753]  8.38 32.94 90 top
OPTO_EL37_1A  Speed Pulse  [SOP-4_L4.4-W2.8-P1.27-LS7.0-TL]  141.48 13.46 270 top
OPTO_EL37_1B  Speed Pulse  [SOP-4_L4.4-W2.8-P1.27-LS7.0-TL]  130.05 13.46 270 top
OPTO_EL37_2A  Speed Pulse  [SOP-4_L4.4-W2.8-P1.27-LS7.0-TL]  126.11 13.46 270 top
OPTO_EL37_2B  Speed Pulse  [SOP-4_L4.4-W2.8-P1.27-LS7.0-TL]  114.67 13.46 270 top
OPTO_EL37_3A  Speed Pulse  [SOP-4_L4.4-W2.8-P1.27-LS7.0-TL]  110.74 13.46 270 top
OPTO_EL37_3B  Speed Pulse  [SOP-4_L4.4-W2.8-P1.27-LS7.0-TL]  99.28 13.46 270 top
OPTO_EL37_4A  Speed Pulse  [SOP-4_L4.4-W2.8-P1.27-LS7.0-TL]  95.38 13.46 270 top
OPTO_EL37_4B  Speed Pulse  [SOP-4_L4.4-W2.8-P1.27-LS7.0-TL]  83.9 13.46 270 top
OPTO_EL37_5A  Speed Pulse  [SOP-4_L4.4-W2.8-P1.27-LS7.0-TL]  80.01 13.46 270 top
OPTO_EL37_5B  Speed Pulse  [SOP-4_L4.4-W2.8-P1.27-LS7.0-TL]  68.52 13.46 270 top
OPTO_EL37_6A  Speed Pulse  [SOP-4_L4.4-W2.8-P1.27-LS7.0-TL]  64.64 13.46 270 top
OPTO_EL37_6B  Speed Pulse  [SOP-4_L4.4-W2.8-P1.27-LS7.0-TL]  53.13 13.46 270 top
OPTO_EL37_7A  Speed Pulse  [SOP-4_L4.4-W2.8-P1.27-LS7.0-TL]  49.28 13.46 270 top
OPTO_EL37_7B  Speed Pulse  [SOP-4_L4.4-W2.8-P1.27-LS7.0-TL]  37.75 13.46 270 top
OPTO_EL37_8A  Speed Pulse  [SOP-4_L4.4-W2.8-P1.27-LS7.0-TL]  33.91 13.46 270 top
OPTO_EL37_8B  Speed Pulse  [SOP-4_L4.4-W2.8-P1.27-LS7.0-TL]  22.37 13.46 270 top
OPTO_EL37_9A  Speed Pulse  [SOP-4_L4.4-W2.8-P1.27-LS7.0-TL]  18.54 13.46 270 top
OPTO_EL37_9B  Speed Pulse  [SOP-4_L4.4-W2.8-P1.27-LS7.0-TL]  6.98 13.46 270 top
Q1  AON7544  [DFN-8_L3.2-W3.1-P0.65-LS3.4-BL]  6.39 38.28 90 top
R1  200Ω  [R0805]  133.6 16.64 180 top
R2  200Ω  [R0805]  118.24 16.64 180 top
R3  200Ω  [R0805]  122.83 16.64 0 top
R4  200Ω  [R0805]  107.47 16.64 0 top
R5  200Ω  [R0805]  102.87 16.64 180 top
R6  200Ω  [R0805]  92.12 16.64 0 top
R7  200Ω  [R0805]  87.5 16.64 180 top
R8  200Ω  [R0805]  61.42 16.64 0 top
R9  200Ω  [R0805]  56.77 16.64 180 top
R10  200Ω  [R0805]  46.07 16.64 0 top
R11  200Ω  [R0805]  41.4 16.64 180 top
R12  200Ω  [R0805]  30.72 16.64 0 top
R13  200Ω  [R0805]  26.03 16.64 180 top
R14  200Ω  [R0805]  15.37 16.64 0 top
R15  200Ω  [R0805]  10.67 16.64 180 top
R16  200Ω  [R0805]  72.14 16.64 180 top
R17  200Ω  [R0805]  76.77 16.64 0 top
R27  4.7kΩ  [R0402]  20.57 44.32 0 top
R28  1.5kΩ  [R0402]  18.67 44.32 0 top
R29  15kΩ  [R0402]  36.83 43.18 180 top
R48  200Ω  [R0805]  138.18 16.64 0 top
R50  220Ω  [R0402]  25.91 26.36 180 top
R51  220Ω  [R0402]  25.91 25.19 180 top
R52  220Ω  [R0402]  25.91 24.01 180 top
R53  220Ω  [R0402]  25.91 22.84 180 top
R54  220Ω  [R0402]  25.91 21.67 180 top
R55  220Ω  [R0402]  25.91 20.5 180 top
R63  220Ω  [R0402]  25.91 29.84 0 top
R64  220Ω  [R0402]  25.91 28.7 0 top
R65  220Ω  [R0402]  25.91 27.53 0 top
R92  4.7kΩ  [R0805]  3.81 17.4 270 top
R93  4.7kΩ  [R0805]  1.91 17.4 270 top
U1  1MD1T1B1M1QES-5  [SW-TH_6P-L12.7-W11.4-P4.7-LS4.8_1MD1T1B1M1QES-5#2]  135.7 6.86 90 top
U2  1MD1T1B1M1QES-5  [SW-TH_6P-L12.7-W11.4-P4.7-LS4.8_1MD1T1B1M1QES-5#3]  120.33 6.86 90 top
U3  1MD1T1B1M1QES-5  [SW-TH_6P-L12.7-W11.4-P4.7-LS4.8_1MD1T1B1M1QES-5]  104.95 6.86 90 top
U4  1MD1T1B1M1QES-5  [SW-TH_6P-L12.7-W11.4-P4.7-LS4.8_1MD1T1B1M1QES-5]  89.58 6.86 90 top
U5  1MD1T1B1M1QES-5  [SW-TH_6P-L12.7-W11.4-P4.7-LS4.8_1MD1T1B1M1QES-5]  58.83 6.86 90 top
U6  1MD1T1B1M1QES-5  [SW-TH_6P-L12.7-W11.4-P4.7-LS4.8_1MD1T1B1M1QES-5]  43.45 6.86 90 top
U7  1MD1T1B1M1QES-5  [SW-TH_6P-L12.7-W11.4-P4.7-LS4.8_1MD1T1B1M1QES-5]  28.08 6.86 90 top
U8  1MD1T1B1M1QES-5  [SW-TH_6P-L12.7-W11.4-P4.7-LS4.8_1MD1T1B1M1QES-5]  12.7 6.86 90 top
U9  1MD1T1B1M1QES-5  [SW-TH_6P-L12.7-W11.4-P4.7-LS4.8_1MD1T1B1M1QES-5]  74.2 6.86 90 top
U19  -  [TSSOP-28_L9.7-W4.4-P0.65-LS6.4-TL]  18.29 24.38 180 top
U26  NCV68061SNAIT1G  [TSOP-6_L3.0-W1.5-P0.95-BL]  5.46 41.78 270 top
U27  TPS5430DDAR  [ESOP-8_L4.9-W3.9-P1.27-LS6.0-TL-EP]  16.3 40.82 180 top

## Footprints (pads in the part's own frame, mm; a bottom-side part is the same pattern mirrored in y, then rotated)
C0402
  rect 0.79x0.54 smd: 1(-0.545,0) 2(0.545,0)
C0603
  rect 0.8x0.9 smd: 1(-0.7,0) 2(0.7,0)
C1206
  rect 1.485x1.728 smd: 1(-1.593,0) 2(1.593,0)
DFN-8_L3.2-W3.1-P0.65-LS3.4-BL
  rect 0.4x0.6 smd: 1(-0.975,-1.52) 2(-0.325,-1.52) 3(0.325,-1.52) 4(0.975,-1.52) 5(0.975,1.52) 6(0.325,1.52) 7(-0.325,1.52) 8(-0.975,1.52)
  rect 2.6x2.05 smd: 9(0,0.35)
ESOP-8_L4.9-W3.9-P1.27-LS6.0-TL-EP
  rect 1.3x0.6 smd: 1(-2.7,1.905) 2(-2.7,0.635) 3(-2.7,-0.635) 4(-2.7,-1.905) 5(2.7,-1.905) 6(2.7,-0.635) 7(2.7,0.635) 8(2.7,1.905)
  rect 2.5x3.5 smd: 9(0,0)
IND-SMD_L7.0-W6.6_FXL0630
  rect 2.424x3.62 smd: 1(3.128,0) 2(-3.128,0)
LED0805-R-RD
  rect 1x1.399 smd: 1(1.05,0) 2(-1.05,0)
Pad_e0
  oval 2x4 smd: 1(0,0)
Pad_e18
  oval 2x4 smd: 1(0,0)
Pad_e19
  oval 2x4 smd: 1(0,0)
Pad_e20
  oval 2x4 smd: 1(0,0)
Pad_e796
  oval 2x4 smd: 1(0,0)
Pad_e798
  oval 2x4 smd: 1(0,0)
Pad_e799
  oval 2x4 smd: 1(0,0)
Pad_e800
  oval 2x4 smd: 1(0,0)
Pad_e2753
  oval 2x4 smd: 1(0,0)
R0402
  rect 0.566x0.54 smd: 1(-0.433,0) 2(0.433,0)
R0805
  rect 1.133x1.377 smd: 1(-1,0) 2(1,0)
SMA_L4.4-W2.8-LS5.4-R-RD
  rect 2.062x1.539 smd: 1(2.503,0) 2(-2.503,0)
SOD-323_L1.8-W1.3-LS2.5-RD
  rect 1x0.75 smd: 1(-1.173,0) 2(1.173,0)
SOP-4_L4.4-W2.8-P1.27-LS7.0-TL
  oval 1.71x0.56 smd: 1(-3.255,0.635) 2(-3.255,-0.635) 3(3.255,-0.635) 4(3.255,0.635)
SW-TH_6P-L12.7-W11.4-P4.7-LS4.8_1MD1T1B1M1QES-5
  oval 3x4 hole 1.5x2.5: 1(-4.7,2.415) 4(-4.7,-2.415)
  oval 1.7x3 hole 1.5x2.5: 2(0,2.415) 5(0,-2.415)
  oval 1x1 hole 1.1: 3(4.7,2.415) 6(4.7,-2.415)
SW-TH_6P-L12.7-W11.4-P4.7-LS4.8_1MD1T1B1M1QES-5#2
  oval 3x4 hole 1.5x2.5: 1(-4.7,2.415) 2(0,2.415) 4(-4.7,-2.415) 5(0,-2.415)
  oval 1x1 hole 1.1: 3(4.7,2.415) 6(4.7,-2.415)
SW-TH_6P-L12.7-W11.4-P4.7-LS4.8_1MD1T1B1M1QES-5#3
  oval 3x4 hole 1.5x2.5: 1(-4.7,2.415) 4(-4.7,-2.415)
  oval 1.7x3.1 hole 1.5x2.5: 2(0,2.415) 5(0,-2.415)
  oval 1x1 hole 1.1: 3(4.7,2.415) 6(4.7,-2.415)
TSOP-6_L3.0-W1.5-P0.95-BL
  rect 0.532x1.095 smd: 1(-0.95,-1.147) 2(0,-1.147) 3(0.95,-1.147) 4(0.95,1.147) 5(0,1.147) 6(-0.95,1.147)
TSSOP-28_L9.7-W4.4-P0.65-LS6.4-TL
  oval 1.804x0.406 smd: 1(-3.2,4.225) 2(-3.2,3.575) 3(-3.2,2.925) 4(-3.2,2.275) 5(-3.2,1.625) 6(-3.2,0.975) 7(-3.2,0.325) 8(-3.2,-0.325) 9(-3.2,-0.975) 10(-3.2,-1.625) 11(-3.2,-2.275) 12(-3.2,-2.925) 13(-3.2,-3.575) 14(-3.2,-4.225) 15(3.2,-4.225) 16(3.2,-3.575) 17(3.2,-2.925) 18(3.2,-2.275) 19(3.2,-1.625) 20(3.2,-0.975) 21(3.2,-0.325) 22(3.2,0.325) 23(3.2,0.975) 24(3.2,1.625) 25(3.2,2.275) 26(3.2,2.925) 27(3.2,3.575) 28(3.2,4.225)

## Nets
As in the schematic, except:
+5V: C36.2 C61.2 D7.1 LED6.1 NOREF#3.1 NOREF#6.1 R92.2 R93.2 U19.28
GND: C36.1 C55.1 C57.1 C59.1 C60.1 C61.1 D6.1 NOREF.1 NOREF#7.1 OPTO_EL37_1A.2 OPTO_EL37_1B.2 OPTO_EL37_2A.2 OPTO_EL37_2B.2 OPTO_EL37_3A.2 OPTO_EL37_3B.2 OPTO_EL37_4A.2 OPTO_EL37_4B.2 OPTO_EL37_5A.2 OPTO_EL37_5B.2 OPTO_EL37_6A.2 OPTO_EL37_6B.2 OPTO_EL37_7A.2 OPTO_EL37_7B.2 OPTO_EL37_8A.2 OPTO_EL37_8B.2 OPTO_EL37_9A.2 OPTO_EL37_9B.2 R28.1 R29.2 U19.14 U19.23 U19.25 U26.2 U26.4 U27.6 U27.9
9-16V: C55.2 NOREF#9.1 Q1.5 Q1.6 Q1.7 Q1.8 Q1.9 U26.3 U26.6
SCL: NOREF#2.1 NOREF#8.1 R93.1 U19.26
SDA: NOREF#4.1 NOREF#5.1 R92.1 U19.27

Pads without a net: U1 3 6; U2 2 3 5 6; U3 2 3 5 6; U4 2 3 5 6; U5 2 3 5 6; U6 2 3 5 6; U7 2 3 5 6; U8 2 3 5 6; U9 2 3 5 6; U19 1 2 3 4 5 16 17 18 19 20 21 22 24; U26 1; U27 2 3 5

## Via types
v1: diameter 0.62, hole 0.31, Top Layer to Bottom Layer, 18 vias
v2: diameter 0.61, hole 0.305, Top Layer to Bottom Layer, 83 vias

## Routing (per net, layer and track width the routed paths; a pad name or vN(x,y) marks a point on that pad's centre or on a via; arc(x,y) is an arc through that point)
5V_A: length 139.1
  Top Layer w0.8: v1(49.91,8.89) OPTO_EL37_7A.4 ; v1(126.75,8.89) OPTO_EL37_2A.4 ; v1(111.38,8.89) OPTO_EL37_3A.4 ; v1(34.54,8.89) OPTO_EL37_8A.4 ; v1(19.18,8.89) OPTO_EL37_9A.4 ; v1(96.01,8.89) OPTO_EL37_4A.4 ; v1(65.28,8.89) OPTO_EL37_6A.4 ; v1(80.64,8.89) OPTO_EL37_5A.4 ; v1(142.11,8.89) OPTO_EL37_1A.4
  Bottom Layer w0.8: 139.19,9.4 142.11,9.4 v1(142.11,8.89) ; 139.19,9.4 138.12,8.32 U1.5 ; 139.19,9.4 138.56,10.03 134.24,10.03 133.22,9.02 126.87,9.02 v1(126.75,8.89) ; 126.68,8.89 126.56,9.02 19.24,9.02 19.11,8.89
5V_B: length 135.6
  Top Layer w0.8: OPTO_EL37_2B.4 115.47,10.03 v1(116.19,10.03) ; OPTO_EL37_3B.4 100.09,10.03 v1(100.81,10.03) ; v1(54.66,10.03) 53.94,10.03 OPTO_EL37_6B.4 ; v1(70.04,10.03) 69.33,10.03 OPTO_EL37_5B.4 ; OPTO_EL37_8B.4 23.18,10.03 v1(23.89,10.03) ; OPTO_EL37_4B.4 84.71,10.03 v1(85.42,10.03) ; v1(39.27,10.03) 38.56,10.03 OPTO_EL37_7B.4 ; v1(8.51,10.03) 7.79,10.03 OPTO_EL37_9B.4 ; OPTO_EL37_1B.4 130.86,10.03 v1(131.57,10.03) 133.28,8.32 U1.2
  Bottom Layer w0.8: v1(131.57,10.03) v1(116.19,10.03) v1(100.81,10.03) v1(85.42,10.03) v1(70.04,10.03) v1(54.66,10.03) v1(39.27,10.03) v1(23.89,10.03) v1(8.51,10.03)
+5V: length 59.1
  Top Layer w0.4: 2.29,16.4 R92.2 6.97,19.56 NOREF#3.1 8.78,19.96 14.89,19.96 14.95,20.02 ; v2(19.69,33.53) 19.69,33.91 21.59,35.81 31.68,35.81 C61.2 ; C36.2 14.95,20.02 ; 14.95,20.02 15.12,20.19 v2(18.16,20.19)
  Top Layer w0.45: C61.2 33.9,37.66 NOREF#6.1
  Top Layer w0.8: C61.2 33.53,39.91 D7.1 LED6.1
  Bottom Layer w0.4: v2(19.69,33.53) 19.69,21.72 v2(18.16,20.19)
+12V: length 14.7
  Top Layer w0.4: Q1.3 9,38.61 8.84,38.45 8.35,37.96 Q1.2 ; 8.37,37.31 Q1.1
  Top Layer w0.45: 8.37,37.31 8.84,37.78 8.84,38.45 ; 9,38.61 9.01,38.6
  Top Layer w0.5: 10.48,40.19 10.48,40.32 8.76,42.04 8.76,44.26 8.58,44.45 C57.2
  Top Layer w0.8: U27.7 10.6,40.19 9.01,38.6
GND:
  vias: v2(1.78,34.92) v2(1.91,31.37) v2(2.03,28.32) v2(2.03,25.15) v2(2.03,22.22) v2(2.54,44.2) v2(2.92,38.61) v2(3.81,36.32) v2(4.32,13.59) v2(4.7,29.46) v2(4.7,26.16) v2(4.95,34.04) v2(6.22,31.24) v2(6.22,27.81) v2(6.69,24.51) v2(6.73,21.21) v2(6.98,46.35) v2(7.11,13.51) v2(8.76,35.56) v2(10.41,24.51) v2(10.41,21.08) v2(10.67,27.94) v2(10.67,18.41) v2(10.8,31.5) v2(11.05,45.18) v2(12.06,34.42) v2(12.57,29.72) v2(12.57,26.28) v2(13.21,37.34) v2(14.99,33.78) v2(16.3,40.82) v2(16.64,45.85) v2(18.29,26.97) v2(18.29,24.37) v2(18.29,21.81) v2(23.24,46.23) v2(23.77,33.53) v2(24.89,18.92) v2(25.65,41.02) v2(26.8,34.42) v2(28.07,46.35) v2(28.08,18.92) v2(30.73,21.34) v2(32.89,19.3) v2(34.8,22.22) v2(35.05,25.15) v2(35.31,33.78) v2(35.43,46.1) v2(35.56,37.34) v2(36.96,19.94) v2(37.34,25.15) v2(37.72,22.61) v2(38.35,29.08) v2(38.86,36.45) v2(39.24,45.08) v2(39.88,40.26) v2(39.88,20.45) v2(41.4,18.92) v2(41.53,42.42) v2(42.29,36.45) v2(42.29,24.51) v2(43.81,29.08) v2(44.07,40) v2(44.83,18.41) v2(45.59,36.45) v2(45.59,32) v2(46.36,29.34) v2(46.48,20.07) v2(46.99,25.65)
9-16V: length 18.7
  Top Layer w0.5: Q1.9 5.46,38.86 5.46,42.29 5.9,42.73 U26.6 ; 1.78,40.83 4.31,40.83 U26.3 4.63,40.51 5.21,40.51 5.08,40.39 5.08,39.62 ; Q1.8 Q1.7 Q1.6 Q1.5 4.87,39.62
  Top Layer w1: NOREF#9.1 6.04,35.28 Q1.9
SCL: length 58.2
  Top Layer w0.4: U19.26 13.34,21.46 12.19,22.61 12.19,24.38 10.33,26.25 10.07,26.25 ; NOREF#2.1 8.17,26.35 7.6,26.35 1.78,20.53 1.78,18.53 R93.1
  Top Layer w0.45: NOREF#8.1 40.79,31.11 14.93,31.11 10.07,26.25 NOREF#2.1
SDA: length 55.9
  Top Layer w0.4: R92.1 3.81,20.32 6.43,22.94 8.09,22.94 8.13,22.9 NOREF#5.1 9.74,22.9 11.83,20.81 U19.27
  Top Layer w0.45: 11.83,20.81 11.83,21.44 v2(11.81,21.46) ; v2(11.81,29.21) 11.81,30.35 13.34,31.88 39.5,31.88 40.62,33 NOREF#4.1
  Bottom Layer w0.45: v2(11.81,29.21) v2(11.81,21.46)
SW1: length 116.4
  Top Layer w0.4: R63.2 40.39,29.84 51.82,18.41 132.83,18.41 R1.1 137.05,16.64 137.18,16.51
SW1_A: length 16
  Top Layer w0.8: 140.84,10.21 140.84,11.3 141.35,11.81 143.13,11.81 143.13,5.97 139.32,2.16 U1.4
SW1_B: length 9.7
  Top Layer w0.8: U1.1 129.41,6.03 129.41,10.21
SW2: length 107.4
  Top Layer w0.4: v2(29.21,28.7) R64.2 ; v2(35.43,18.67) 35.43,16.64 38.69,13.38 117.25,13.38 119.24,15.37 R2.1 121.7,16.64 121.83,16.51
  Bottom Layer w0.4: v2(29.21,28.7) 31.88,26.03 31.88,22.22 v2(35.43,18.67)
SW2_A: length 9.6
  Top Layer w0.8: 125.48,10.08 125.48,3.94 123.7,2.16 U2.4
SW2_B: length 9.7
  Top Layer w0.8: OPTO_EL37_2B.3 114.03,6.04 U2.1
SW3: length 88.9
  Top Layer w0.4: R65.2 37.11,27.53 46.1,18.54 46.1,15.11 47.28,13.93 101.16,13.93 R5.1 106.35,16.64 106.47,16.51
SW3_A: length 9.2
  Top Layer w0.8: U3.4 110.11,4.9 110.11,10.21
SW3_B: length 9.7
  Top Layer w0.8: U3.1 98.65,6.05 OPTO_EL37_3B.3
SW4: length 72.2
  Top Layer w0.4: R50.1 36.25,26.36 v2(36.32,26.29) ; v2(40.01,26.29) 42.29,26.29 50.8,17.78 50.8,15.12 51.44,14.48 86.35,14.48 R7.1 91,16.64 91.12,16.51
  Bottom Layer w0.4: v2(36.32,26.29) v2(40.01,26.29)
SW4_A: length 9.2
  Top Layer w0.8: OPTO_EL37_4A.3 94.74,4.91 U4.4
SW4_B: length 9.7
  Top Layer w0.8: OPTO_EL37_4B.3 83.26,6.05 U4.1
SW5: length 60.2
  Top Layer w0.4: R17.1 74.55,15.41 v2(74.55,15.37) ; 75.64,16.64 R16.1 ; v2(38.73,19.81) 33.36,25.19 R51.1
  Bottom Layer w0.4: v2(74.55,15.37) 73.41,14.22 39.75,14.22 38.99,14.99 38.99,19.56 v2(38.73,19.81)
SW5_A: length 9.2
  Top Layer w0.8: U9.4 79.38,4.92 OPTO_EL37_5A.3
SW5_B: length 9.7
  Top Layer w0.8: OPTO_EL37_5B.3 67.88,6.06 U9.1
SW6: length 42.7
  Top Layer w0.4: v2(43.69,18.29) 37.97,24 v2(36.37,24) ; v2(59.05,15.37) 59.15,15.37 R8.1 ; R52.1 33.39,24.01 v2(33.4,24) ; 60.29,16.64 R9.1
  Bottom Layer w0.4: v2(43.69,18.29) 43.69,15.62 44.45,14.86 58.55,14.86 v2(59.05,15.37) ; v2(33.4,24) v2(36.37,24)
SW6_A: length 9.2
  Top Layer w0.8: OPTO_EL37_6A.3 64.01,4.93 U5.4
SW6_B: length 9.7
  Top Layer w0.8: U5.1 52.5,6.07 OPTO_EL37_6B.3
SW7: length 21.4
  Top Layer w0.254: R11.1 44.94,16.64 45.07,16.51
  Top Layer w0.4: R53.1 32.91,22.84 37.47,18.29 40.75,18.29 R11.1
SW7_A: length 9.2
  Top Layer w0.8: U6.4 48.64,4.93 OPTO_EL37_7A.3
SW7_B: length 9.7
  Top Layer w0.8: OPTO_EL37_7B.3 37.12,6.08 U6.1
SW8: length 10
  Top Layer w0.254: 29.72,16.51 29.65,16.57 ; 29.59,16.64 R13.1
  Top Layer w0.4: R12.1 29.72,19.94 27.99,21.67 R54.1
SW8_A: length 9.2
  Top Layer w0.8: U7.4 33.27,4.94 OPTO_EL37_8A.3
SW8_B: length 9.7
  Top Layer w0.8: OPTO_EL37_8B.3 21.73,6.09 U7.1
SW9: length 23.4
  Top Layer w0.254: 12.32,16.64 14.24,16.64 14.37,16.51
  Top Layer w0.4: R15.1 12.32,16.64 14.73,14.22 25.27,14.22 26.12,15.07 26.12,17.95 26.34,18.17 R55.1
SW9_A: length 9.2
  Top Layer w0.8: U8.4 17.91,4.95 OPTO_EL37_9A.3
SW9_B: length 9.7
  Top Layer w0.8: U8.1 6.35,6.09 OPTO_EL37_9B.3
$1N1117: length 4.3
  Top Layer w0.4: 142.11,16.59 142.11,15.87 141.61,15.37 140.32,15.37 139.18,16.51
$1N1124: length 2
  Top Layer w0.4: R1.2 130.76,16.64 OPTO_EL37_1B.1
$1N1139: length 2
  Top Layer w0.4: OPTO_EL37_2B.1 115.38,16.64 R2.2
$1N1144: length 4.3
  Top Layer w0.4: 126.75,16.59 126.75,15.87 126.24,15.37 124.97,15.37 123.83,16.51
$1N1153: length 4.3
  Top Layer w0.4: 111.38,16.59 111.38,16.13 110.49,15.24 109.74,15.24 108.47,16.51
$1N1160: length 2
  Top Layer w0.4: OPTO_EL37_3B.1 100,16.64 R5.2
$1N1171: length 4.3
  Top Layer w0.4: 96.01,16.59 96.01,16 95.25,15.24 94.39,15.24 93.12,16.51
$1N1178: length 2
  Top Layer w0.4: OPTO_EL37_4B.1 84.61,16.64 R7.2
$1N1189: length 4.4
  Top Layer w0.4: 62.42,16.51 63.69,15.24 64.64,15.24 65.28,15.87 65.28,16.59
$1N1196: length 2
  Top Layer w0.4: OPTO_EL37_6B.1 53.85,16.64 R9.2
$1N1207: length 4.3
  Top Layer w0.4: 49.91,16.59 49.91,15.75 49.53,15.37 48.21,15.37 47.07,16.51
$1N1214: length 2
  Top Layer w0.254: OPTO_EL37_7B.1 38.47,16.64 R11.2
$1N1225: length 4.2
  Top Layer w0.254: 31.72,16.51 32.86,15.37 33.91,15.37 34.54,16 34.54,16.59
$1N1232: length 2.1
  Top Layer w0.254: OPTO_EL37_8B.1 24.95,16.72 R13.2
$1N1243: length 4.1
  Top Layer w0.254: 19.18,16.59 19.18,16 18.54,15.37 17.51,15.37 16.37,16.51
$1N1250: length 2.1
  Top Layer w0.254: R15.2 9.59,16.72 OPTO_EL37_9B.1
$1N1265: length 2
  Top Layer w0.4: OPTO_EL37_5B.1 69.23,16.64 R16.2
$1N1270: length 4.3
  Top Layer w0.4: 80.64,16.59 80.64,16 79.88,15.24 79.04,15.24 77.77,16.51
$2N1134: length 4.3
  Top Layer w0.4: 25.48,28.7 23.75,28.7 23.01,27.96 U19.13
$2N1136: length 4.1
  Top Layer w0.4: 25.48,27.53 25.45,27.56 23.62,27.56 23.37,27.31 U19.12
$2N1138: length 4.1
  Top Layer w0.4: 25.48,26.36 25.17,26.66 U19.11
$2N1140: length 4.3
  Top Layer w0.4: U19.10 24.65,26.01 25.48,25.19
$2N1142: length 4.5
  Top Layer w0.4: 25.48,24.01 24.13,25.36 U19.9
$2N1144: length 4.8
  Top Layer w0.4: U19.8 23.61,24.71 25.48,22.84
$2N1161: length 10.9
  Top Layer w0.4: 25.48,29.84 18.8,29.84 17.56,28.61 15.09,28.61
$2N1591: length 5
  Top Layer w0.4: 25.48,21.67 23.09,24.06 U19.7
$2N1593: length 5.2
  Top Layer w0.4: 25.48,20.5 22.56,23.41 U19.6
$2N2475: length 16
  Top Layer w0.8: L9.1 25.16,37.4 C58.2 20.89,37.34 15.18,37.34 U27.8 12.21,38.92 D6.2
$2N2476: length 2.7
  Top Layer w0.4: R29.1 37.37,43.07 LED6.2
$2N2478: length 15.6
  Top Layer w0.8: R27.2 25.48,44.32 L9.2 29.7,44.15 C59.2 30.58,43.27 D7.2 30.86,40.23 C60.2
$2N2479: length 1.7
  Top Layer w1: U27.4 19.56,43.28 19.56,44.2
$2N2480: length 2
  Top Layer w0.4: C58.1 20.84,38.92 U27.1
$2N2481: length 3.4
  Top Layer w0.4: U26.5 7.24,41.78 7.91,41.11 Q1.4

## Copper pours and planes (outline as drawn; the poured copper is in the pictures)
GND on Top Layer: -3.81,50.8 153.54,50.8 153.54,11.56 -3.81,11.56
GND on Bottom Layer: -10.03,50.29 159.64,50.29 159.64,10.92 -10.03,10.92

## Text on the board
Top Silkscreen Layer: 4.7kΩ | 220Ω | 5V A4 A5 GND | SDA SCL | PCA9685 | Amatron / AgOpenGPS | VIN / GND / SCL / SDA / 5V
